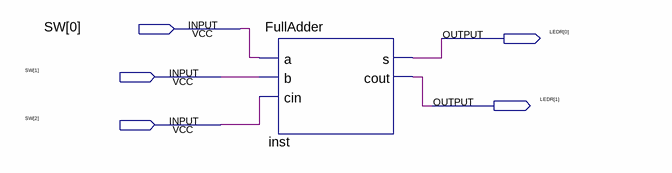
[diagram p0: schematic sheet]
// Quartus schematic addeddemo.bdf as structural Verilog: 1 symbols, 5 pins
module addeddemo (
  input  [2:0] SW,
  output [1:0] LEDR
);

  FullAdder inst (.a(SW[0]), .b(SW[1]), .cin(SW[2]), .s(LEDR[0]), .cout(LEDR[1]));
endmodule
